# EAGLE design tempLogger (EAGLE 7.7.0)
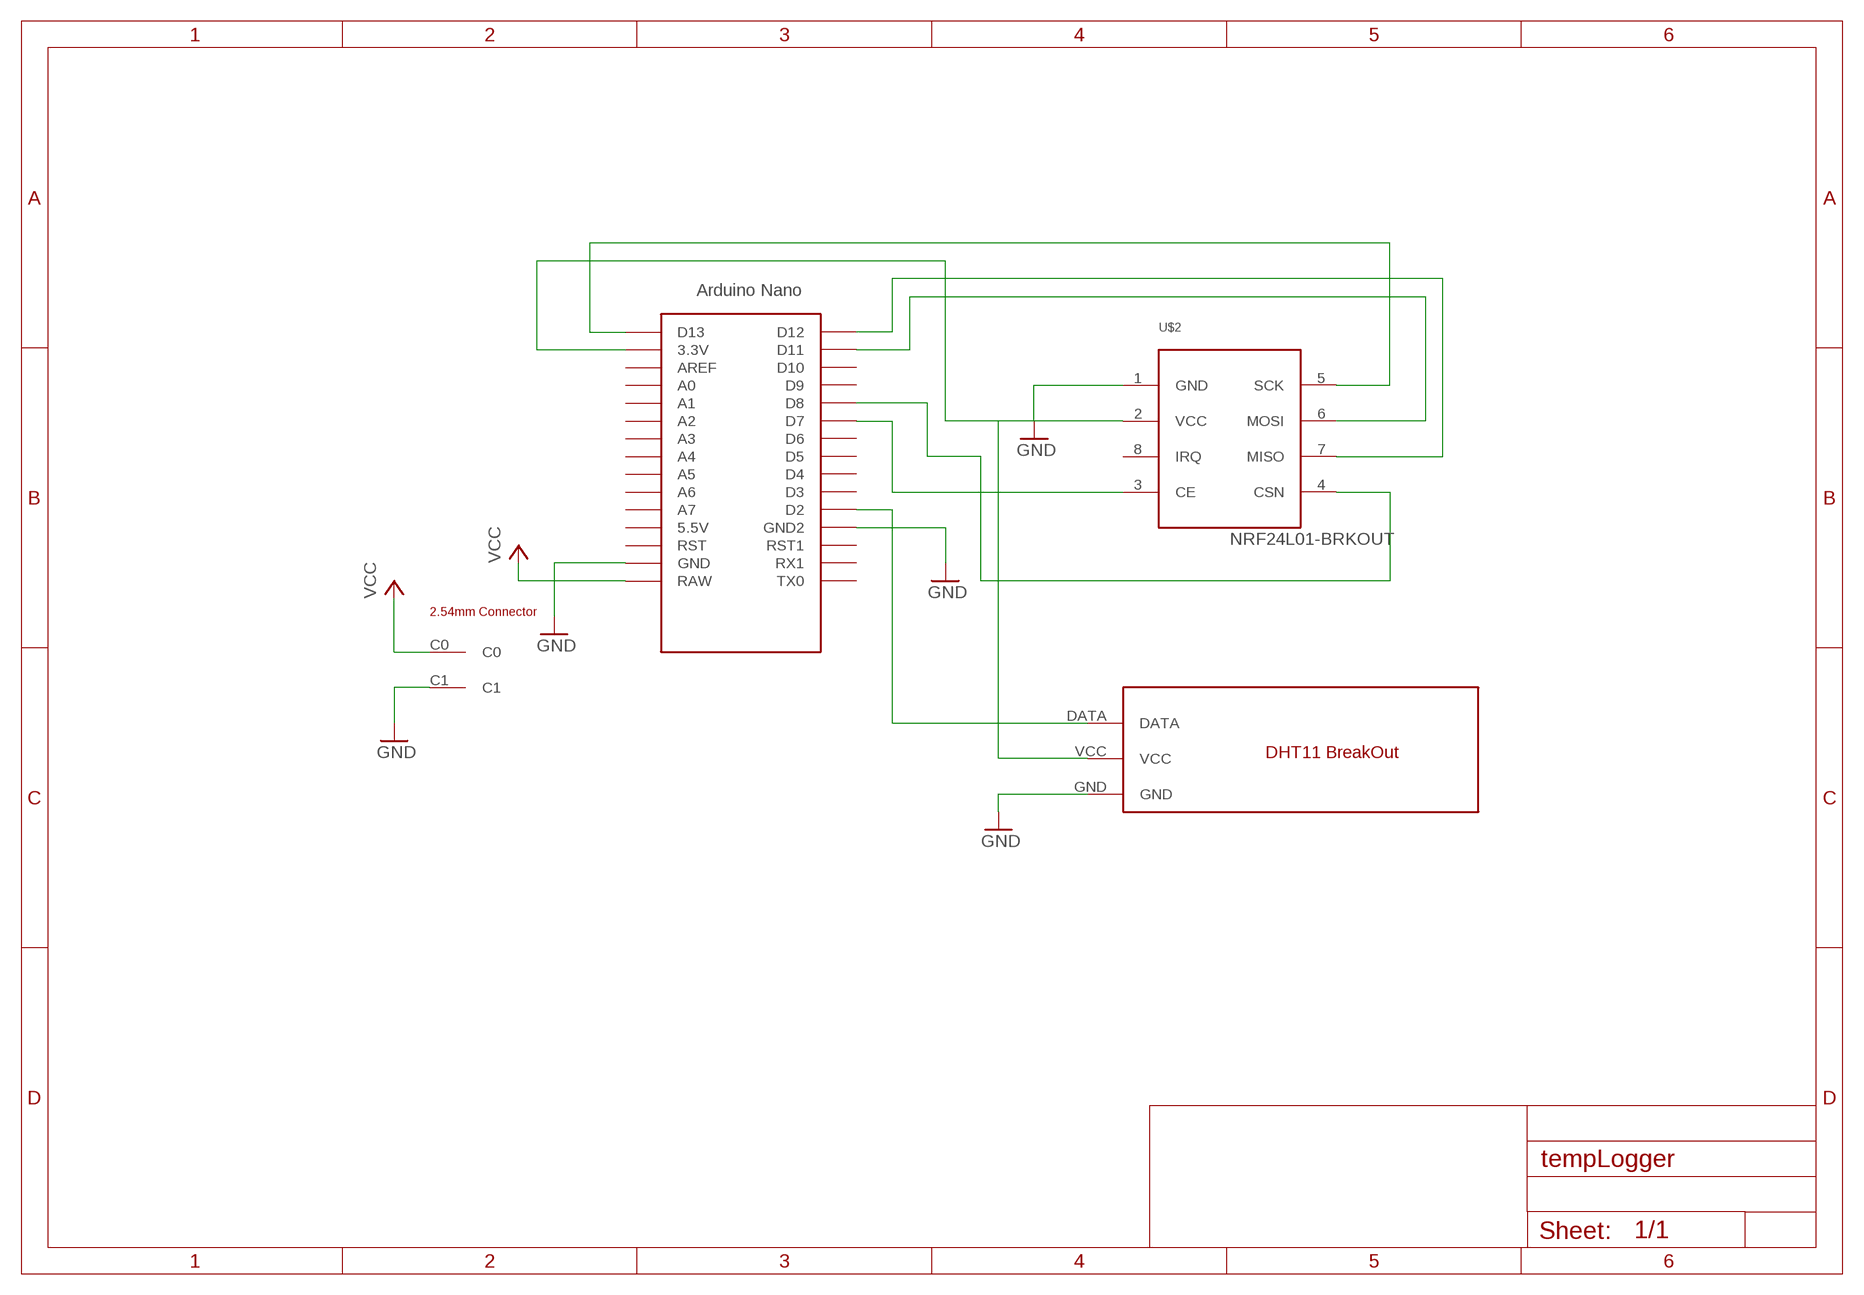
[diagram p0: schematic, sheet 1]

## Parts
U$1  NANO  [NANO]
U$2  NRF24L01-BRKOUT  [NRF24L01-BKKOUT]
U$3  DHT11BREAKOUTVERTICAL  [DHT11BREAKOUT_VERTICAL]
U$4  TWO_PINS_CONNECTOR_2_54MM  [TWO_PINS_CONNECTOR_2_54MM]

## Nets
GND: U$1.GND U$1.GND1(GND2) U$2.1(GND) U$3.GND U$4.C1
N$1: U$1.3.3V U$2.2(VCC) U$3.VCC
N$2: U$1.D13 U$2.5(SCK)
N$3: U$1.D12 U$2.7(MISO)
N$4: U$1.D11 U$2.6(MOSI)
N$5: U$1.D7 U$2.3(CE)
N$6: U$1.D8 U$2.4(CSN)
N$7: U$1.D2 U$3.DATA
VCC: U$1.RAW U$4.C0
Unconnected: U$1.5V(5.5V) U$1.A0 U$1.A1 U$1.A2 U$1.A3 U$1.A4 U$1.A5 U$1.A6 U$1.A7 U$1.AREF U$1.D3 U$1.D4 U$1.D5 U$1.D6 U$1.D9 U$1.D10 U$1.ICSP1 U$1.ICSP2 U$1.ICSP3 U$1.ICSP4 U$1.ICSP5 U$1.ICSP6 U$1.RST U$1.RST1 U$1.RX1 U$1.TX0 U$2.8(IRQ)

## Library data of the parts
U$1 = Arduino-clone:NANO: Arduino Nano
U$2 = nrf24l01-breakout:NRF24L01-BRKOUT
U$3 = Saif:DHT11BREAKOUT: DHT11 temperature and humidity sensor
U$4 = Saif:TWO_PINS_CONNECTOR_2_54MM: A simple two wores connector pad

## Board
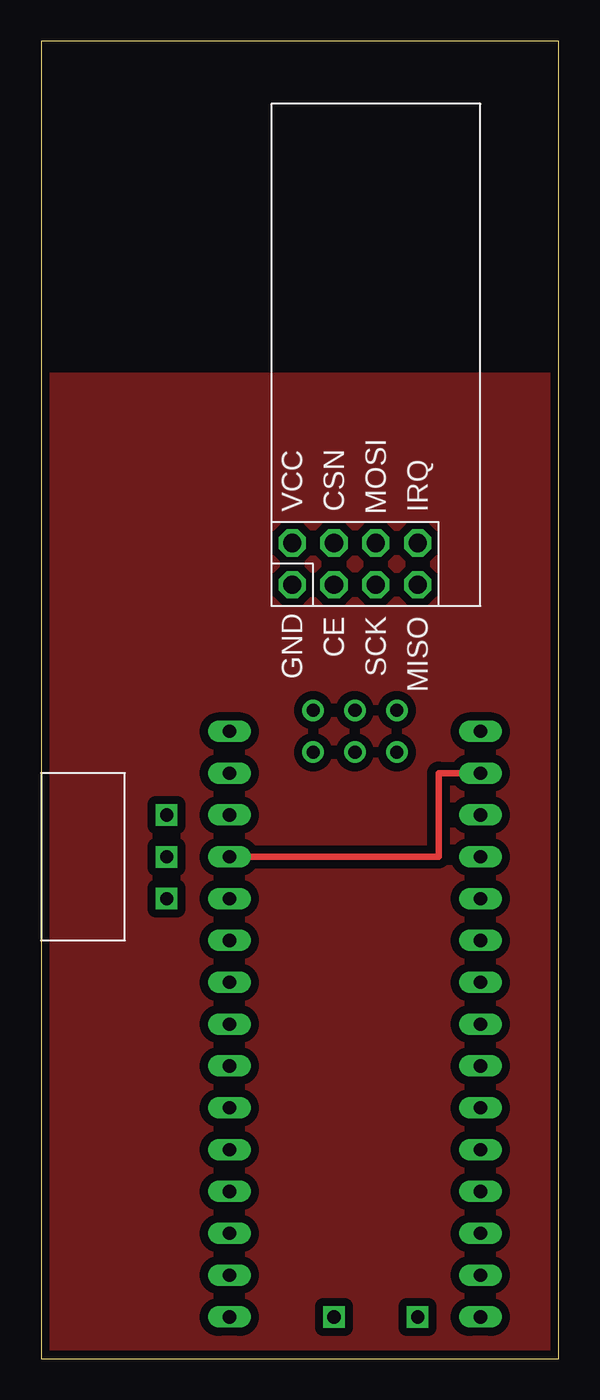
[diagram p1: board, top side]
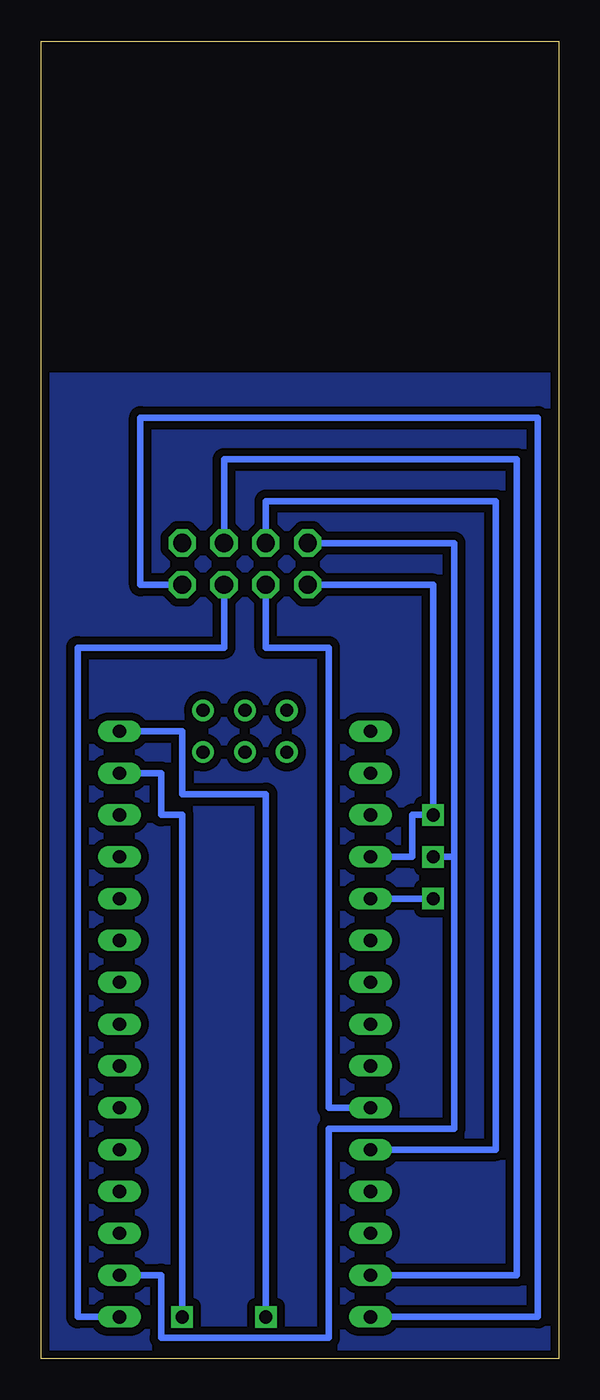
[diagram p2: board, bottom side, seen from below]

Size 31.42 x 80 mm. Coordinates in mm from the lower left corner, seen from the top.
Outline: 0,0 31.42,0 31.42,80 0,80 0,0
Copper layers (1*16): Top 0.035mm / dielectric 1.5mm / Bottom 0.035mm
Design rules "default *": minimum track width 0.3mm, minimum drill 24mil, track to track 0.5mm, track to pad 0.4mm, pad to pad 0.3mm, via to via 0.3mm, smd to smd 8mil, copper to edge 0.5mm, drill to drill 8mil, minimum pad ring 10mil, minimum via ring 8mil, stop-mask expansion 4mil, vias tented up to drill 0mil, thermal gap 10mil

### Footprints (pad centres in the part's own frame; a part is rotated, then mirrored left to right if it is on the bottom)
NANO = drill 0.8 long: 3.3V -10.16,24.13; 5V -10.16,-1.27; A0 -10.16,19.05; A1 -10.16,16.51; A2 -10.16,13.97; A3 -10.16,11.43; A4 -10.16,8.89; A5 -10.16,6.35; A6 -10.16,3.81; A7 -10.16,1.27; AREF -10.16,21.59; D2 5.08,1.27; D3 5.08,3.81; D4 5.08,6.35; D5 5.08,8.89; D6 5.08,11.43; D7 5.08,13.97; D8 5.08,16.51; D9 5.08,19.05; D10 5.08,21.59; D11 5.08,24.13; D12 5.08,26.67; D13 -10.16,26.67; GND -10.16,-6.35; GND1 5.08,-1.27; RAW -10.16,-8.89; RST -10.16,-3.81; RST1 5.08,-3.81; RX1 5.08,-6.35; TX0 5.08,-8.89 | drill 0.8: ICSP1 -5.08,-10.16; ICSP2 -5.08,-7.62; ICSP3 -2.54,-10.16; ICSP4 -2.54,-7.62; ICSP5 0,-10.16; ICSP6 0,-7.62
NRF24L01-BKKOUT = drill 1.1 octagon: 1 1.27,-3.81; 2 -1.27,-3.81; 3 1.27,-1.27; 4 -1.27,-1.27; 5 1.27,1.27; 6 -1.27,1.27; 7 1.27,3.81; 8 -1.27,3.81
DHT11BREAKOUT_VERTICAL = drill 0.8 square: DATA 0,2.54; GND 0,-2.54; VCC 0,0
TWO_PINS_CONNECTOR_2_54MM = drill 0.8 square: C0 0,2.54; C1 0,-2.54

### Placement (x,y rotation side)
U$1  16.51,29.21 180 top
U$2  19.05,48.26 270 top
U$3  7.62,30.48 180 top
U$4  20.32,2.54 90 top

### Tracks (layer width: path | path; a pad name or v marks a point on that pad's centre or on a via)
GND
  Top 0.406: U$1.GND1 24.13,30.48 24.13,35.56 U$1.GND
  Bottom 0.406: U$1.GND1 8.89,30.48 8.89,33.02 U$3.GND 7.62,46.99 U$2.1 | U$4.C1 22.86,33.02 24.13,33.02 24.13,35.56 U$1.GND
N$1
  Bottom 0.406: U$3.VCC 6.35,30.48 | 6.35,30.48 6.35,49.53 U$2.2 | U$1.3.3V 24.13,5.08 24.13,1.27 13.97,1.27 13.97,13.97 6.35,13.97 6.35,30.48
N$2
  Bottom 0.406: U$1.D13 29.21,2.54 29.21,43.18 20.32,43.18 U$2.5
N$3
  Bottom 0.406: U$2.7 25.4,46.99 25.4,57.15 1.27,57.15 1.27,2.54 U$1.D12
N$4
  Bottom 0.406: U$2.6 20.32,54.61 2.54,54.61 2.54,5.08 U$1.D11
N$5
  Bottom 0.406: U$1.D7 13.97,15.24 13.97,43.18 17.78,43.18 U$2.3
N$6
  Bottom 0.406: U$1.D8 3.81,12.7 3.81,52.07 17.78,52.07 U$2.4
N$7
  Bottom 0.406: U$3.DATA U$1.D2
N$8
  pour Top: 31.75,59.69 0,59.69 0,0 31.75,0
N$9
  pour Bottom: 31.75,59.69 0,59.69 0,0 31.75,0
VCC
  Bottom 0.406: U$1.RAW 22.86,38.1 22.86,34.29 17.78,34.29 U$4.C0